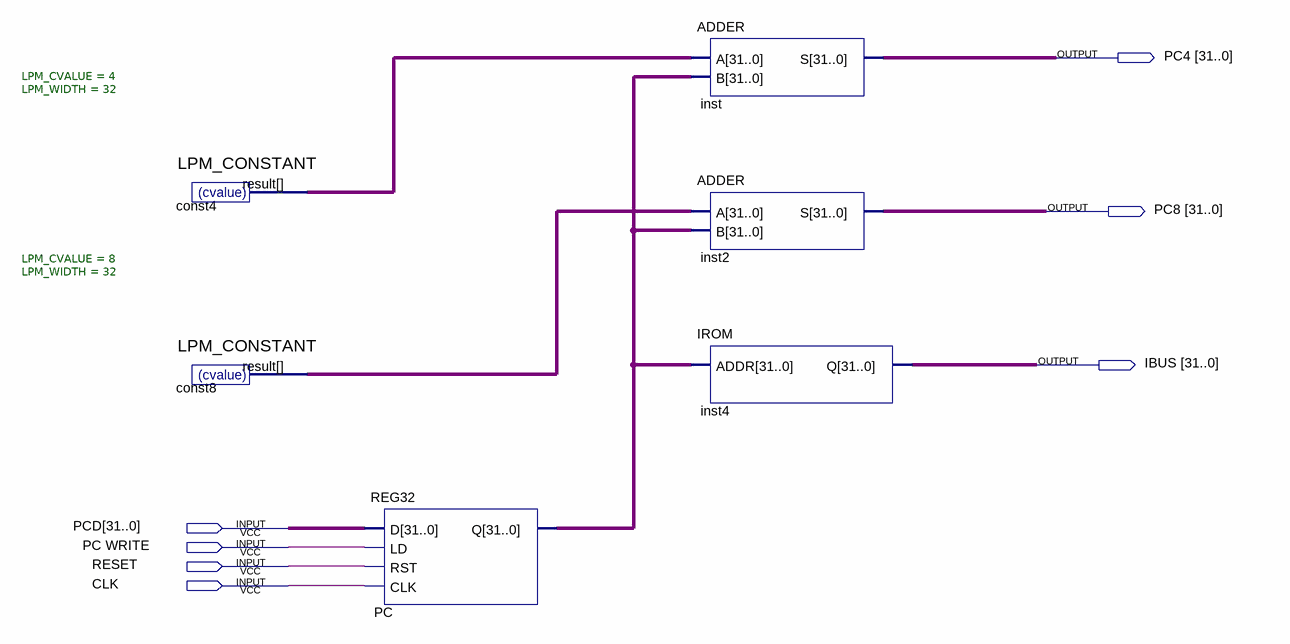
[diagram p0: schematic sheet]
// Quartus schematic SCP.bdf as structural Verilog: 6 symbols, 7 pins
module SCP (
  input  [31:0] PCD,
  input  \PC_WRITE ,
  input  RESET,
  input  CLK,
  output [31:0] PC4,
  output [31:0] PC8,
  output [31:0] IBUS
);

  wire [31:0] const4_result, const8_result, PC_q;

  LPM_CONSTANT #(.LPM_CVALUE(4), .LPM_WIDTH(32)) const4 (.result(const4_result));
  LPM_CONSTANT #(.LPM_CVALUE(8), .LPM_WIDTH(32)) const8 (.result(const8_result));
  REG32 PC (.D(PCD), .LD(\PC_WRITE ), .RST(RESET), .CLK(CLK), .Q(PC_q));
  ADDER inst (.A(const4_result), .B(PC_q), .S(PC4));
  ADDER inst2 (.A(const8_result), .B(PC_q), .S(PC8));
  IROM inst4 (.ADDR(PC_q), .Q(IBUS));
endmodule
